# Altium schematic sheet Logic.SchDoc
size A3
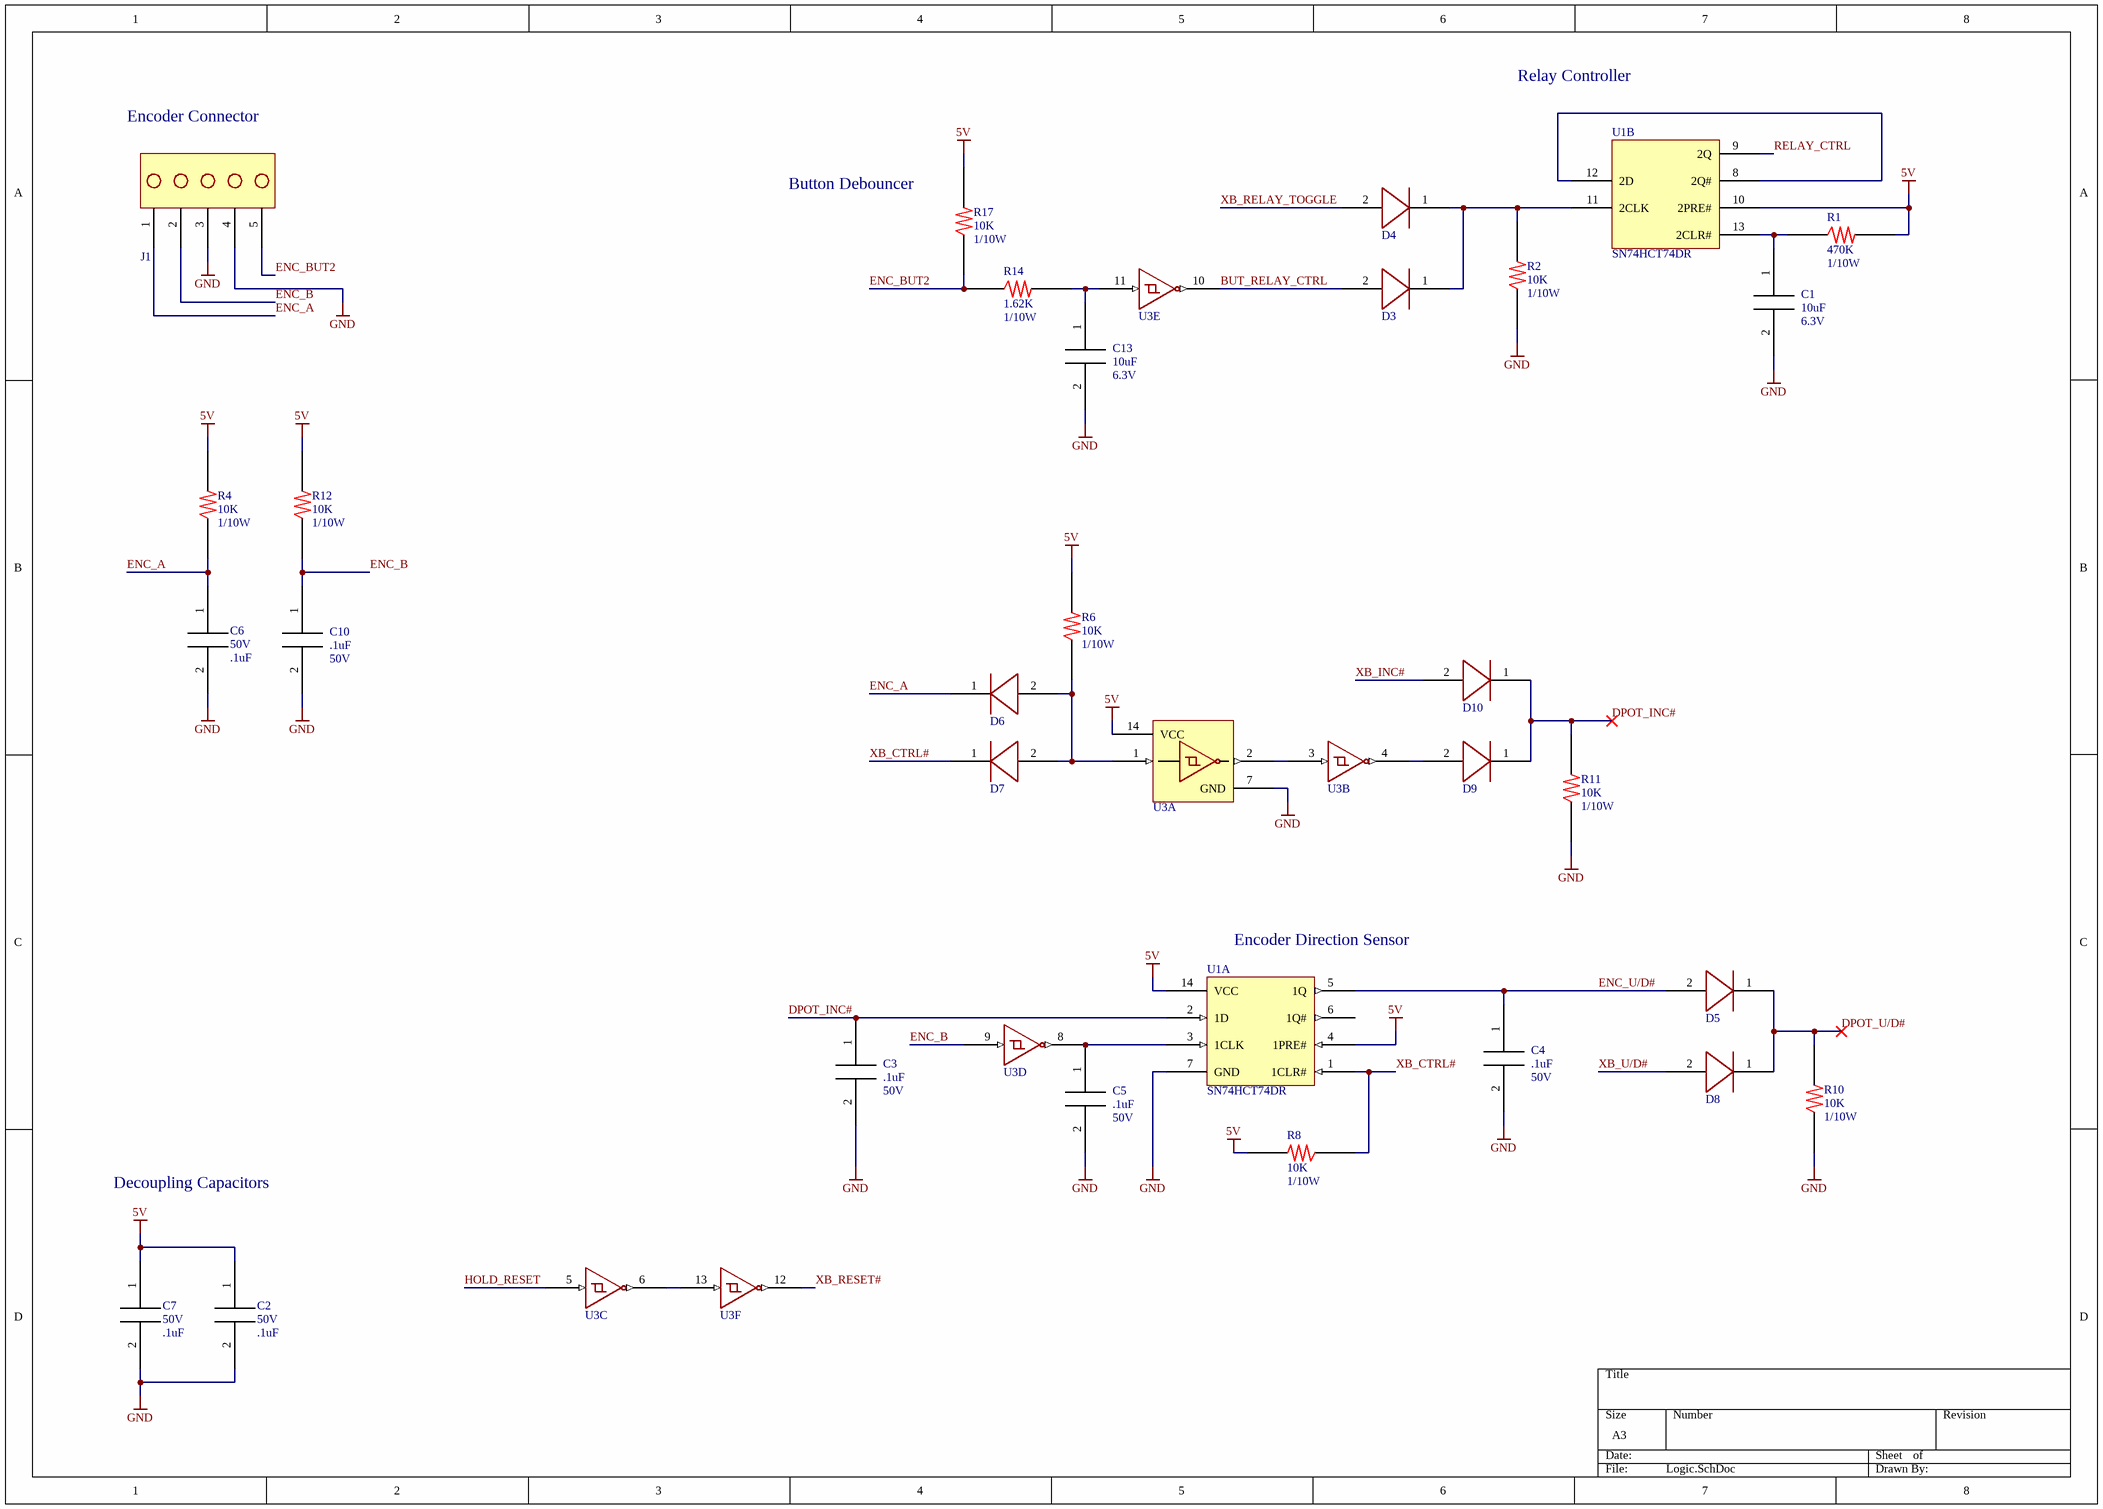
[diagram p0: Logic.SchDoc]

## Parts
C1  value 10uF  Rating: 6.3V  [0603]  (hidden comment: C_CAP_0603)
C2  value .1uF  Rating: 50V  [0603]  (hidden comment: C_CAP_0603)
C3  value .1uF  Rating: 50V  [0603]  (hidden comment: C_CAP_0603)
C4  value .1uF  Rating: 50V  [0603]  (hidden comment: C_CAP_0603)
C5  value .1uF  Rating: 50V  [0603]  (hidden comment: C_CAP_0603)
C6  value .1uF  Rating: 50V  [0603]  (hidden comment: C_CAP_0603)
C7  value .1uF  Rating: 50V  [0603]  (hidden comment: C_CAP_0603)
C10  value .1uF  Rating: 50V  [0603]  (hidden comment: C_CAP_0603)
C13  value 10uF  Rating: 6.3V  [0603]  (hidden comment: C_CAP_0603)
D3  D_DIODE_SOD123  [SOD123]  (value not drawn)
D4  D_DIODE_SOD123  [SOD123]  (value not drawn)
D5  D_DIODE_SOD123  [SOD123]  (value not drawn)
D6  D_DIODE_SOD123  [SOD123]  (value not drawn)
D7  D_DIODE_SOD123  [SOD123]  (value not drawn)
D8  D_DIODE_SOD123  [SOD123]  (value not drawn)
D9  D_DIODE_SOD123  [SOD123]  (value not drawn)
D10  D_DIODE_SOD123  [SOD123]  (value not drawn)
J1  J_RIBBCONN_RIBBCONN  [RIBBCONN]  (value not drawn)
R1  value 470K  Rating: 1/10W  [0603]  (hidden comment: R_RES_0603)
R2  value 10K  Rating: 1/10W  [0603]  (hidden comment: R_RES_0603)
R4  value 10K  Rating: 1/10W  [0603]  (hidden comment: R_RES_0603)
R6  value 10K  Rating: 1/10W  [0603]  (hidden comment: R_RES_0603)
R8  value 10K  Rating: 1/10W  [0603]  (hidden comment: R_RES_0603)
R10  value 10K  Rating: 1/10W  [0603]  (hidden comment: R_RES_0603)
R11  value 10K  Rating: 1/10W  [0603]  (hidden comment: R_RES_0603)
R12  value 10K  Rating: 1/10W  [0603]  (hidden comment: R_RES_0603)
R14  value 1.62K  Rating: 1/10W  [0603]  (hidden comment: R_RES_0603)
R17  value 10K  Rating: 1/10W  [0603]  (hidden comment: R_RES_0603)
U1  PartNumber: SN74HCT74DR  [SOIC14]  (hidden comment: U_DUALDFLIP_SOIC14)  (parts A,B of 2)
U3  U_SN74HCT04DR_SOIC14  [SOIC14]  (value not drawn)  (parts A,B,C,D,E,F of 6)

## Nets
5V: C2.1 C7.1 R1.2 R4.2 R6.2 R8.2 R12.2 R17.2 U1.4(1PRE#) U1.10(2PRE#) U1.14(VCC) U3.14(VCC)
GND: C1.2 C2.2 C3.2 C4.2 C5.2 C6.2 C7.2 C10.2 C13.2 J1.3 J1.4 R2.1 R10.1 R11.1 U1.7(GND) U3.7(GND)
BUT_RELAY_CTRL: D3.2 U3.10
DPOT_INC#: C3.1 D9.1 D10.1 R11.2 U1.2(1D)
DPOT_U/D#: D5.1 D8.1 R10.2
ENC_A: C6.1 D6.1 J1.1 R4.1
ENC_B: C10.1 J1.2 R12.1 U3.9
ENC_BUT2: J1.5 R14.1 R17.1
ENC_U/D#: C4.1 D5.2 U1.5(1Q)
HOLD_RESET: U3.5
RELAY_CTRL: U1.9(2Q)
XB_CTRL#: D7.1 R8.1 U1.1(1CLR#)
XB_INC#: D10.2
XB_RELAY_TOGGLE: D4.2
XB_RESET#: U3.12
XB_U/D#: D8.2
NetC1_1: C1.1 R1.1 U1.13(2CLR#)
NetC5_1: C5.1 U1.3(1CLK) U3.8
NetC13_1: C13.1 R14.2 U3.11
NetD3_1: D3.1 D4.1 R2.2 U1.11(2CLK)
NetD6_2: D6.2 D7.2 R6.1 U3.1
NetD9_2: D9.2 U3.4
NetU1_8: U1.8(2Q#) U1.12(2D)
NetU3_2: U3.2 U3.3
NetU3_6: U3.6 U3.13

Not connected (* = marked no-connect by the designer): U1 6(1Q#)

## Notes on the sheet
- Relay Controller
- Encoder Connector
- (near R17) Button Debouncer
- (near U1) Encoder Direction Sensor
- Decoupling Capacitors

## Library data of the parts
C1 C13 = C_CAP_0603: PartNumber: JMK107ABJ106MA-T; Manufacturer: Taiyo Yuden
C2-C7 C10 = C_CAP_0603: PartNumber: C0603C104K5RACAUTO; Manufacturer: KEMET
D3-D10 = D_DIODE_SOD123: PartNumber: BAS16GWJ; Manufacturer: Nexperia USA Inc; Rating: 215mA
R1 = R_RES_0603: PartNumber: RC0603JR-07470KL; Manufacturer: Yageo
R2 R4 R6 R8 R10-R12 R17 = R_RES_0603: PartNumber: RC0603JR-0710KL; Manufacturer: Yageo
R14 = R_RES_0603: PartNumber: RC0603FR-071K62L; Manufacturer: Yageo
U1 = U_DUALDFLIP_SOIC14: Manufacturer: TI
U3 = U_SN74HCT04DR_SOIC14: Manufacturer: TI; PartNumber: SN74HCT04DR